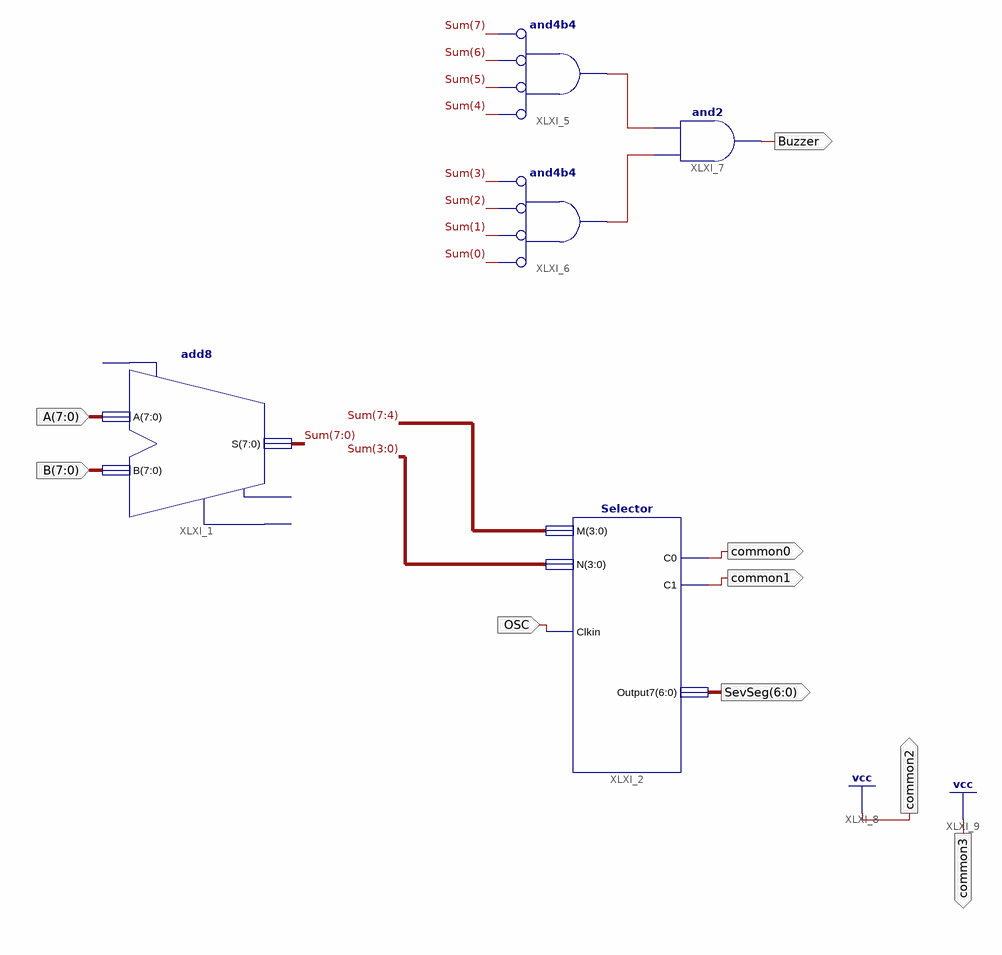
[diagram p0: schematic sheet 1]
// Xilinx ISE schematic main.sch (spartan6) as structural Verilog: 5 symbols, 9 ports
module main (
  input  [7:0] A,
  input  [7:0] B,
  input  OSC,
  output common0,
  output common1,
  output [6:0] SevSeg,
  output Buzzer,
  output common2,
  output common3
);

  wire XLXN_17, XLXN_18;
  wire [7:0] Sum;

  add8 XLXI_1 (.A(A), .B(B), .S(Sum));  // open: CI, CO, OFL
  Selector XLXI_2 (.N(Sum[3:0]), .Clkin(OSC), .M(Sum[7:4]), .Output7(SevSeg), .C0(common0), .C1(common1));
  and XLXI_5 (XLXN_17, ~Sum[4], ~Sum[5], ~Sum[6], ~Sum[7]);  // and4b4
  and XLXI_6 (XLXN_18, ~Sum[0], ~Sum[1], ~Sum[2], ~Sum[3]);  // and4b4
  and XLXI_7 (Buzzer, XLXN_18, XLXN_17);

  assign common2 = 1'b1;
  assign common3 = 1'b1;
endmodule
